# EAGLE schematic PulverTech_v1 (EAGLE 9.5.0)
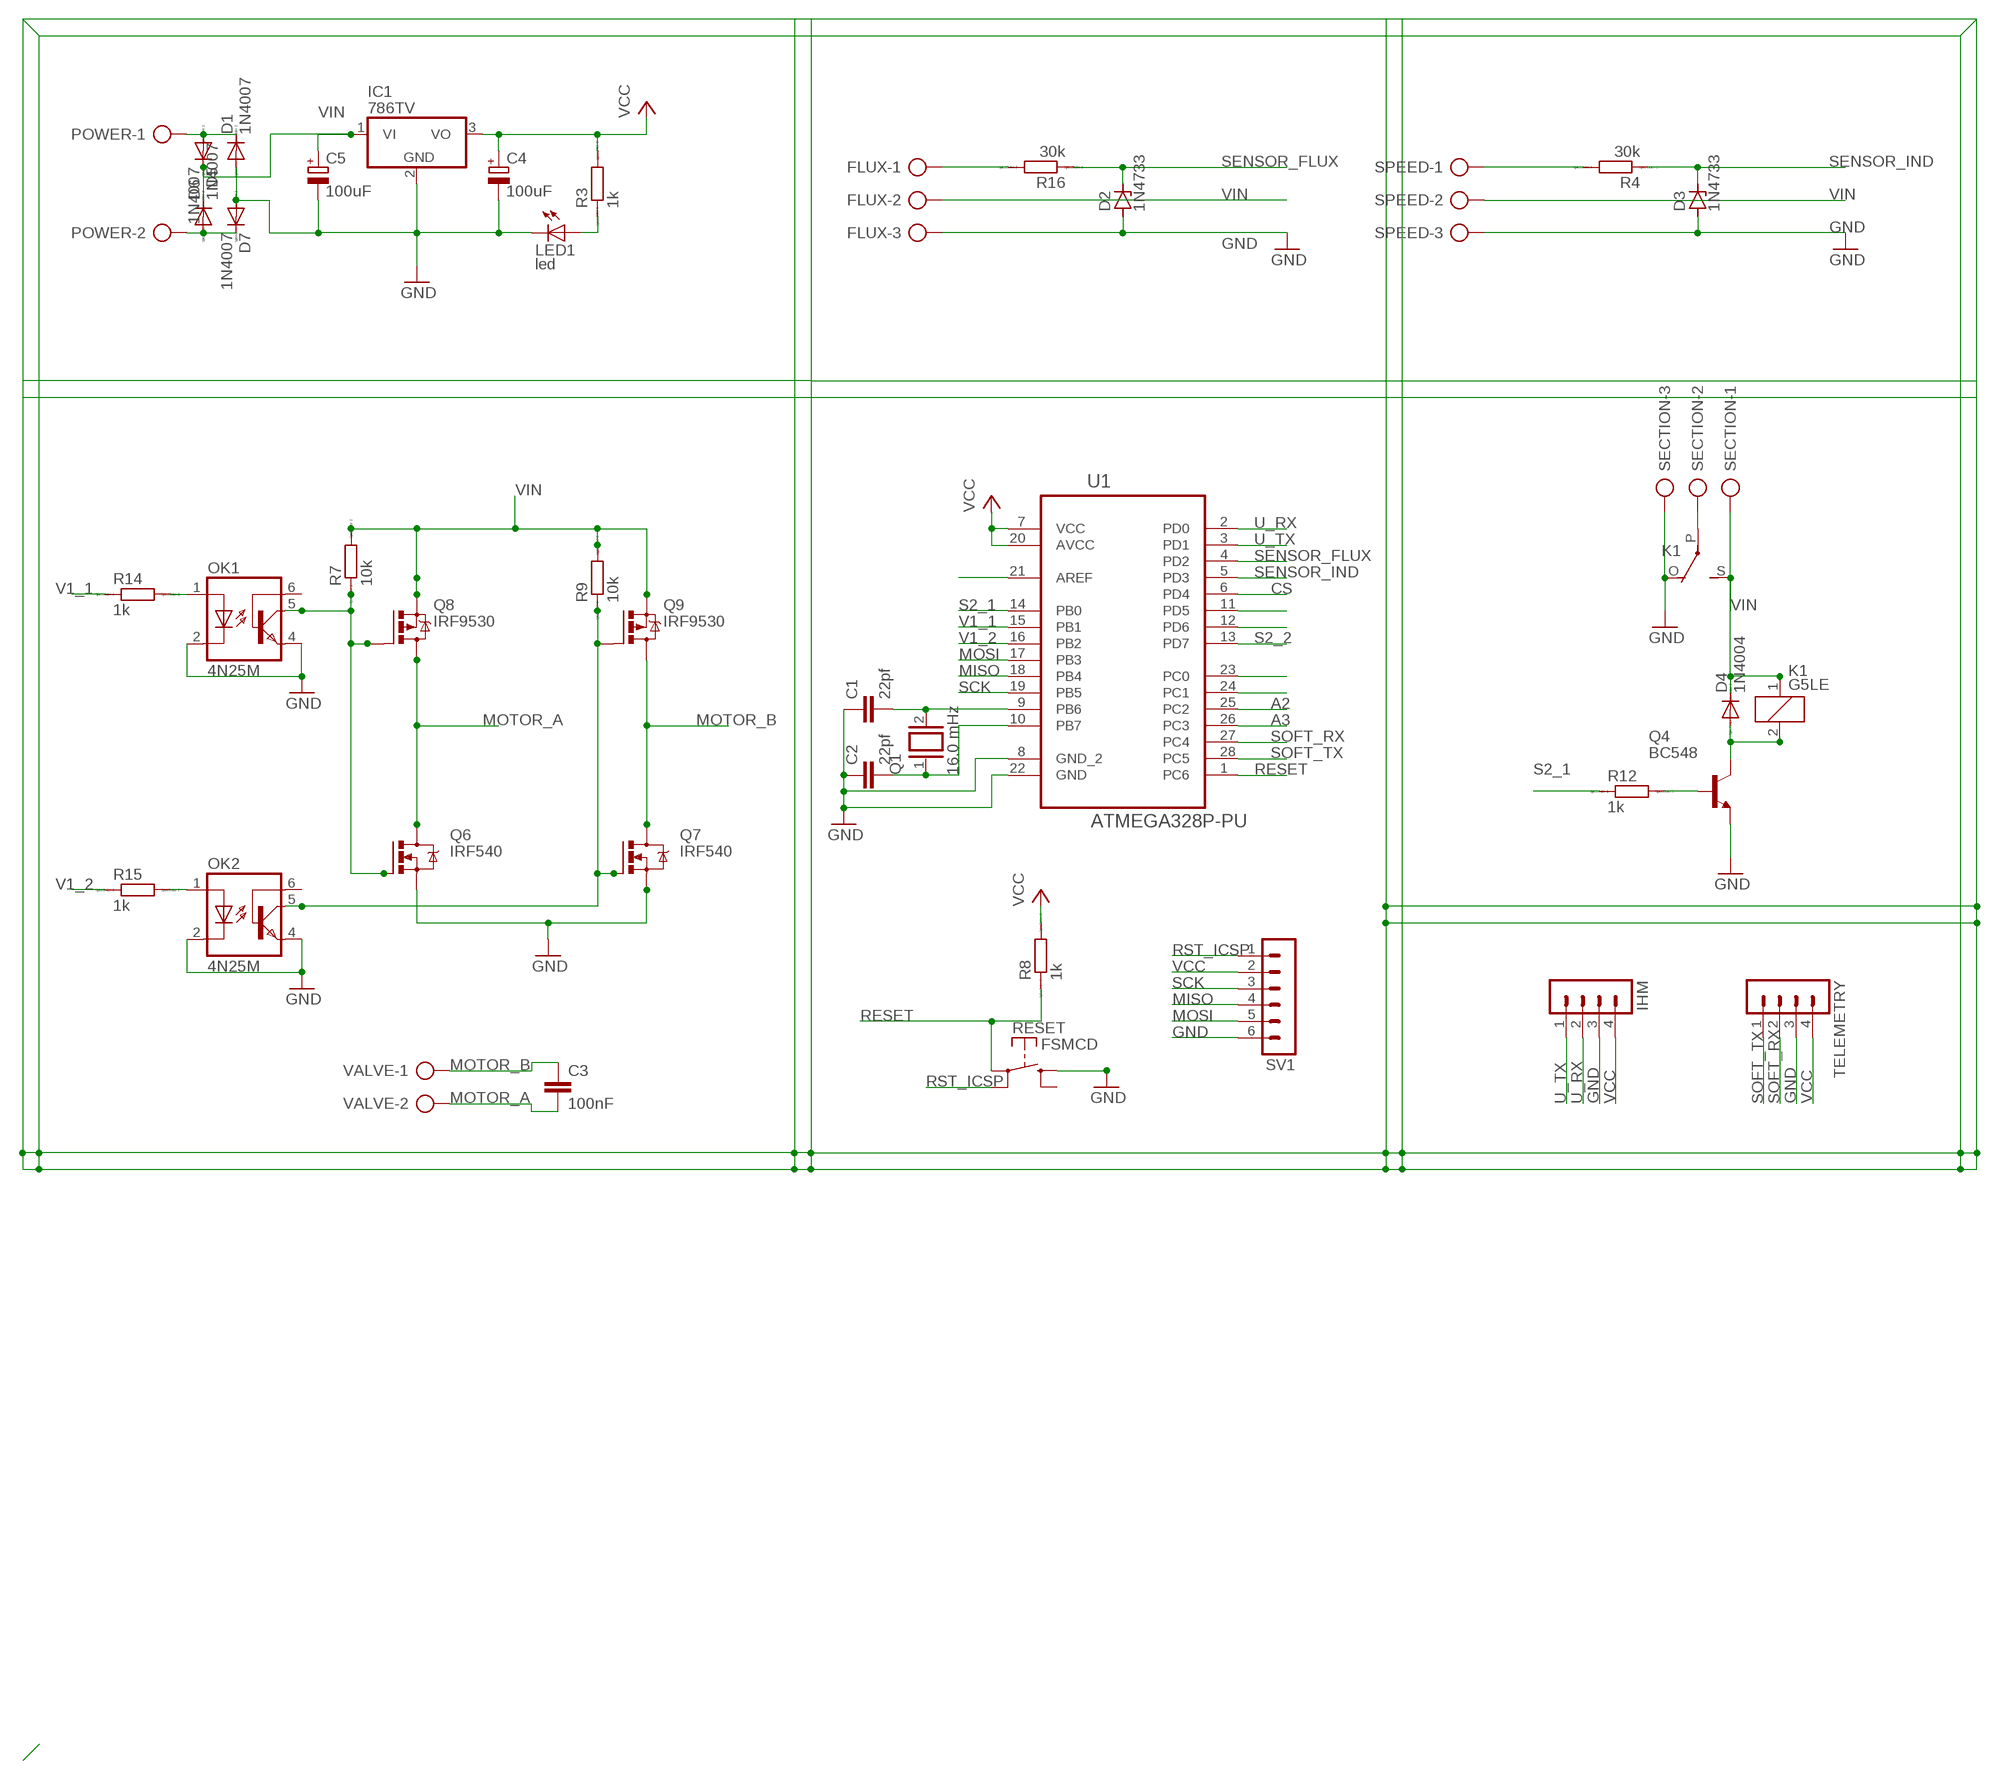
[diagram p0: schematic, sheet 1]

## Parts
C1  22pf  C-EU025-025X050  [C025-025X050]
C2  22pf  C-EU025-025X050  [C025-025X050]
C3  100nF  C2.5/2  [C2.5-2]
C4  100uF  CPOL-EUE2.5-5  [E2,5-5]
C5  100uF  CPOL-EUE2.5-5  [E2,5-5]
D1  1N4007  1N4004  [DO41-10]
D2  1N4733  1N4728  [DO41Z10]
D3  1N4733  1N4728  [DO41Z10]
D4  1N4004  [DO41-10]
D5  1N4007  1N4004  [DO41-10]
D6  1N4007  1N4004  [DO41-10]
D7  1N4007  1N4004  [DO41-10]
FLUX  AK500/3  [AK500/3]
IC1  786TV  [TO220V]
IHM  MA04-1  [MA04-1]
K1  G5LE  [G5LE]
LED1  led  LED3MM  [LED3MM]
OK1  4N25M  [DIL06]
OK2  4N25M  [DIL06]
POWER  AK500/2  [AK500/2]
Q1  16.0 mHz  XTAL/S  [QS]
Q4  BC548  [TO92-EBC]
Q6  IRF540  [TO220BV]
Q7  IRF540  [TO220BV]
Q8  IRF9530  [TO220BV]
Q9  IRF9530  [TO220BV]
R3  1k  R0204/7  [0204/7]
R4  30k  R0204/7  [0204/7]
R7  10k  R0204/7  [0204/7]
R8  1k  R0204/7  [0204/7]
R9  10k  R0204/7  [0204/7]
R12  1k  R0204/7  [0204/7]
R14  1k  R0204/7  [0204/7]
R15  1k  R0204/7  [0204/7]
R16  30k  R0204/7  [0204/7]
RESET  FSMCD  [FSMCD]
SECTION  AK500/3  [AK500/3]
SPEED  AK500/3  [AK500/3]
SV1  MA06-1  [MA06-1]
TELEMETRY  MA04-1  [MA04-1]
U1  ATMEGA328P-PU  [DIP254P762X457-28]
VALVE  AK500/2  [AK500/2]

## Nets
A2: U1.25(PC2)
A3: U1.26(PC3)
CS: U1.6(PD4)
GND: C1.1 C2.1 C4.- C5.- D1.A D2.A D3.A D7.A FLUX.3 IC1.2(GND) IHM.3 K1.O(2:O) LED1.K(C) OK1.2(C) OK1.4(EMI) OK2.2(C) OK2.4(EMI) Q4.E Q6.S Q7.S RESET.P$3(S) SECTION.3 SPEED.3 SV1.6 TELEMETRY.3 U1.8(GND_2) U1.22(GND)
GND2: K1.P(2:P) SECTION.2
MISO: SV1.4 U1.18(PB4)
MOSI: SV1.5 U1.17(PB3)
MOTOR_A: C3.2 Q6.D Q8.D VALVE.2
MOTOR_B: C3.1 Q7.D Q9.D VALVE.1
N$1: C1.2 Q1.2 U1.9(PB6)
N$2: C2.2 Q1.1 U1.10(PB7)
N$3: U1.11(PD5)
N$4: D1.C D5.A POWER.1
N$5: D6.A D7.C POWER.2
N$6: U1.12(PD6)
N$8: R4.2 SPEED.1
N$9: LED1.A R3.1
N$11: U1.21(AREF)
N$12: FLUX.1 R16.2
N$13: U1.23(PC0)
N$14: U1.24(PC1)
N$15: OK1.5(COL) Q6.G Q8.G R7.1
N$16: OK1.1(A) R14.2
N$17: OK2.1(A) R15.2
N$33: D4.A K1.2 Q4.C
N$36: Q4.B R12.2
N$39: OK2.5(COL) Q7.G Q9.G R9.1
RESET: R8.1 RESET.P$1(P) U1.1(PC6)
RST_ICSP: RESET.P$2(P) SV1.1
S2_1: R12.1 U1.14(PB0)
S2_2: U1.13(PD7)
SCK: SV1.3 U1.19(PB5)
SENSOR_FLUX: D2.C R16.1 U1.4(PD2)
SENSOR_IND: D3.C R4.1 U1.5(PD3)
SOFT_RX: TELEMETRY.2 U1.27(PC4)
SOFT_TX: TELEMETRY.1 U1.28(PC5)
U_RX: IHM.2 U1.2(PD0)
U_TX: IHM.1 U1.3(PD1)
V1_1: R14.1 U1.15(PB1)
V1_2: R15.1 U1.16(PB2)
VCC: C4.+ IC1.3(VO) IHM.4 R3.2 R8.2 SV1.2 TELEMETRY.4 U1.7(VCC) U1.20(AVCC)
VIN: C5.+ D4.C D5.C D6.C FLUX.2 IC1.1(VI) K1.1 K1.S(2:S) Q8.S Q9.S R7.2 R9.2 SECTION.1 SPEED.2
Unconnected: OK1.6(BAS) OK2.6(BAS) RESET.P$4(S)

## Library data of the parts
C1 C2 = rcl:C-EU: CAPACITOR, European symbol
C3 = capacitor-wima:C: CAPACITOR naming: grid - package width
C4 C5 = resistor:CPOL-EU: POLARIZED CAPACITOR, European symbol
D1 D4-D7 = diode:1N4004: DIODE general purpose rectifier, 1 A
D2 D3 = diode:1N4728: Z DIODE 3.3 V, 1W, 5 percent
FLUX SECTION SPEED = con-ptr500:AK500/3: CONNECTOR; OC_FARNELL: unknown; OC_NEWARK: unknown
IC1 = linear:78*: Positive VOLTAGE REGULATOR Source: http://cache.national.com/ds/LM/LM78L05.pdf http://www.fairchildsemi.com/ds/LM/LM7805.pdf
IHM TELEMETRY = con-lstb:MA04-1: PIN HEADER; OC_FARNELL: unknown; OC_NEWARK: unknown
K1 = relay:G5LE: RELAY 1 x switch, 10 A/120 V AC, 8 A/30 V DC, Omron; OC_FARNELL: unknown; OC_NEWARK: unknown
LED1 = led:LED: LED OSRAM: - CHIPLED LG R971, LG N971, LY N971, LG Q971, LY Q971, LO R971, LY R971 LH N974, LH R974 LS Q976, LO Q976, LY Q976 LO Q996 - Hyper CHIPLED LW Q18S LB Q993, LB Q99A, LB R99A - SideLED LS A670, LO A670, LY A670, LG A670, LP A670 LB A673, LV A673, LT A673, LW A673 LH A674 LY A675 LS A676, LA A676, LO A676, LY A676, LW A676 LS A679, LY A679, LG A679 - Hyper Micro SIDELED® LS Y876, LA Y876, LO Y876, LY Y876 LT Y87S - SmartLED LW L88C, LW L88S LB L89C, LB L89S, LG L890 LS L89K, LO L89K, LY L89K LS L896, LA L896, LO L896, LY L896 - TOPLED LS T670, LO T670, LY T670, LG T670, LP T670 LSG T670, LSP T670, LSY T670, LOP T670, LYG T670 LG T671, LOG T671, LSG T671 LB T673, LV T673, LT T673, LW T673 LH T674 LS T676, LA T676, LO T676, LY T676, LB T676, LH T676, LSB T676, LW T676 LB T67C, LV T67C, LT T67C, LS T67K, LO T67K, LY T67K, LW E67C LS E67B, LA E67B, LO E67B, LY E67B, LB E67C, LV E67C, LT E67C LW T67C LS T679, LY T679, LG T679 LS T770, LO T770, LY T770, LG T770, LP T770 LB T773, LV T773, LT T773, LW T773 LH T774 LS E675, LA E675, LY E675, LS T675 LS T776, LA T776, LO T776, LY T776, LB T776 LHGB T686 LT T68C, LB T68C - Hyper Mini TOPLED® LB M676 - Mini TOPLED Santana® LG M470 LS M47K, LO M47K, LY M47K Source: http://www.osram.convergy.de LUXEON: - LUMILED® LXK2-PW12-R00, LXK2-PW12-S00, LXK2-PW14-U00, LXK2-PW14-V00 LXK2-PM12-R00, LXK2-PM12-S00, LXK2-PM14-U00 LXK2-PE12-Q00, LXK2-PE12-R00, LXK2-PE12-S00, LXK2-PE14-T00, LXK2-PE14-U00 LXK2-PB12-K00, LXK2-PB12-L00, LXK2-PB12-M00, LXK2-PB14-N00, LXK2-PB14-P00, LXK2-PB14-Q00 LXK2-PR12-L00, LXK2-PR12-M00, LXK2-PR14-Q00, LXK2-PR14-R00 LXK2-PD12-Q00, LXK2-PD12-R00, LXK2-PD12-S00 LXK2-PH12-R00, LXK2-PH12-S00 LXK2-PL12-P00, LXK2-PL12-Q00, LXK2-PL12-R00 Source: www.luxeon.com KINGBRIGHT: KA-3528ASYC Source: www.kingbright.com
OK1 OK2 = optocoupler:4N*?M: General Purpose 6-Pin Phototransistor Optocouplers Source: http://www.fairchildsemi.com/ds/4N/4N35-M.pdf; MPN: 4N25-M; OC_FARNELL: 1021349; OC_NEWARK: 98K9084
POWER VALVE = con-ptr500:AK500/2: CONNECTOR; OC_FARNELL: unknown; OC_NEWARK: unknown
Q1 = special:XTAL/S: CRYSTAL
Q4 = transistor-npn:BC548*: NPN Transistor
Q6 Q7 = transistor-power:IRF540: HEXFET Power MOSFET
Q8 Q9 = transistor-power:IRF9530: P-CHANNEL HEXFET POWER-MOS-FET Source: http://www.irf.com/product-info/datasheets/data/irf9530.pdf
R3 R4 R7-R9 R12 R14-R16 = eagle-ltspice:R: RESISTOR, European symbol; SPICEMODEL: NONE; SPICEPREFIX: R
RESET = switch-misc:FSMCD: TYCO SWITCH
SV1 = con-lstb:MA06-1: PIN HEADER; OC_FARNELL: unknown; OC_NEWARK: unknown
U1 = Atmel_By_element14_Batch_1-00:ATMEGA328P-PU: 8-bit Microcontroller with In-System Programmable Flash; MPN: ATMEGA328P-PU; OC_FARNELL: 1715487; OC_NEWARK: 15R0268; PACKAGE: PDIP-28; SUPPLIER: Atmel

## Net classes
0 default: width 0.813 mm, drill 0.127 mm, clearance 0.508 mm